# EasyEDA Pro project ProDoc_双路无刷电调_2025-08-21.epro, board PCB1_1
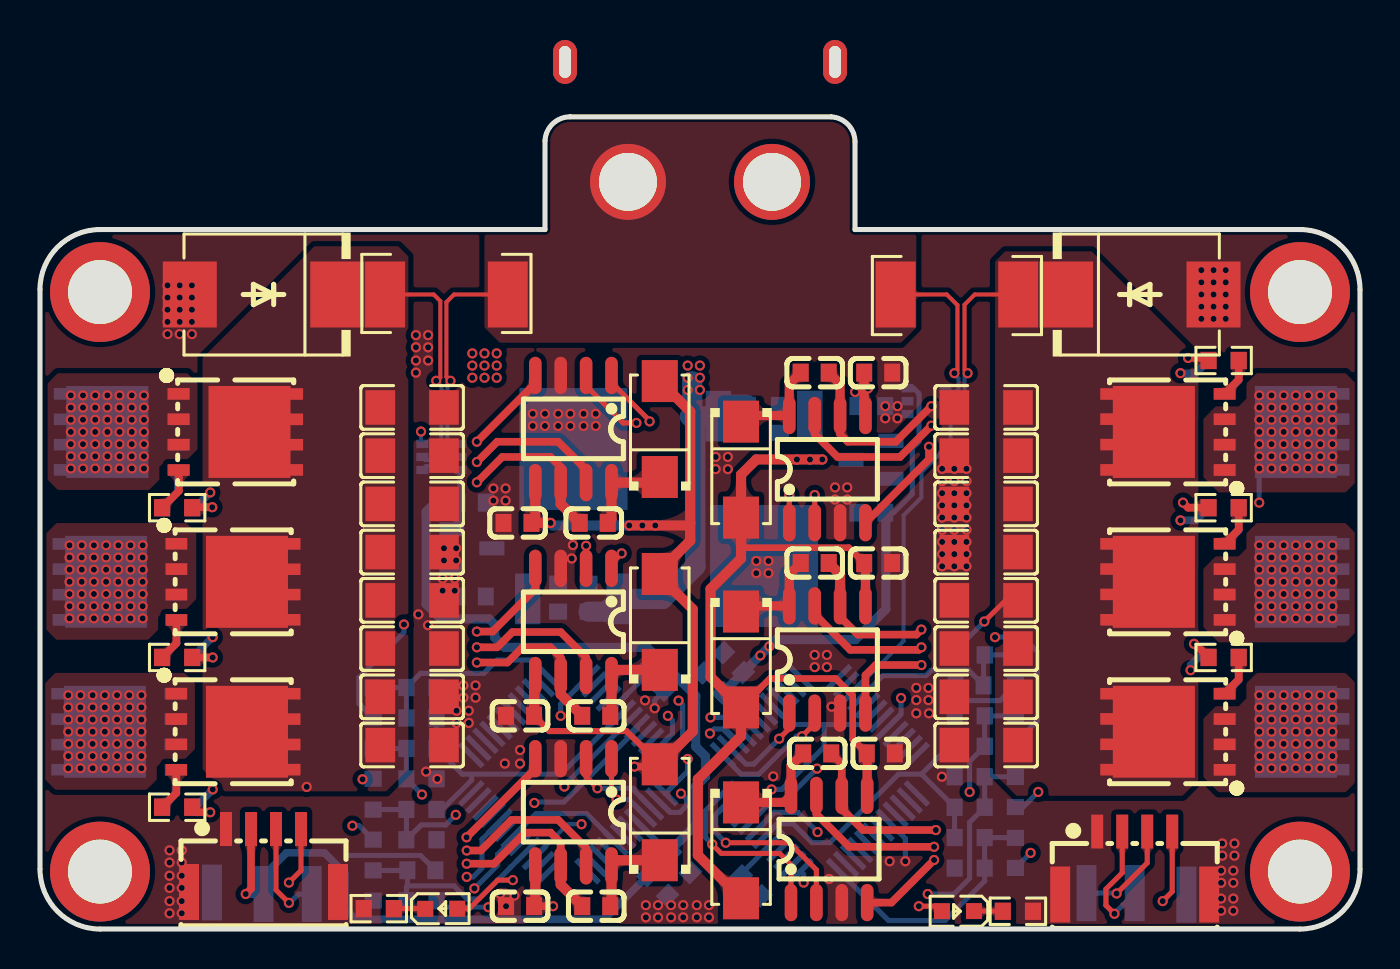
[diagram p2: board, top side]
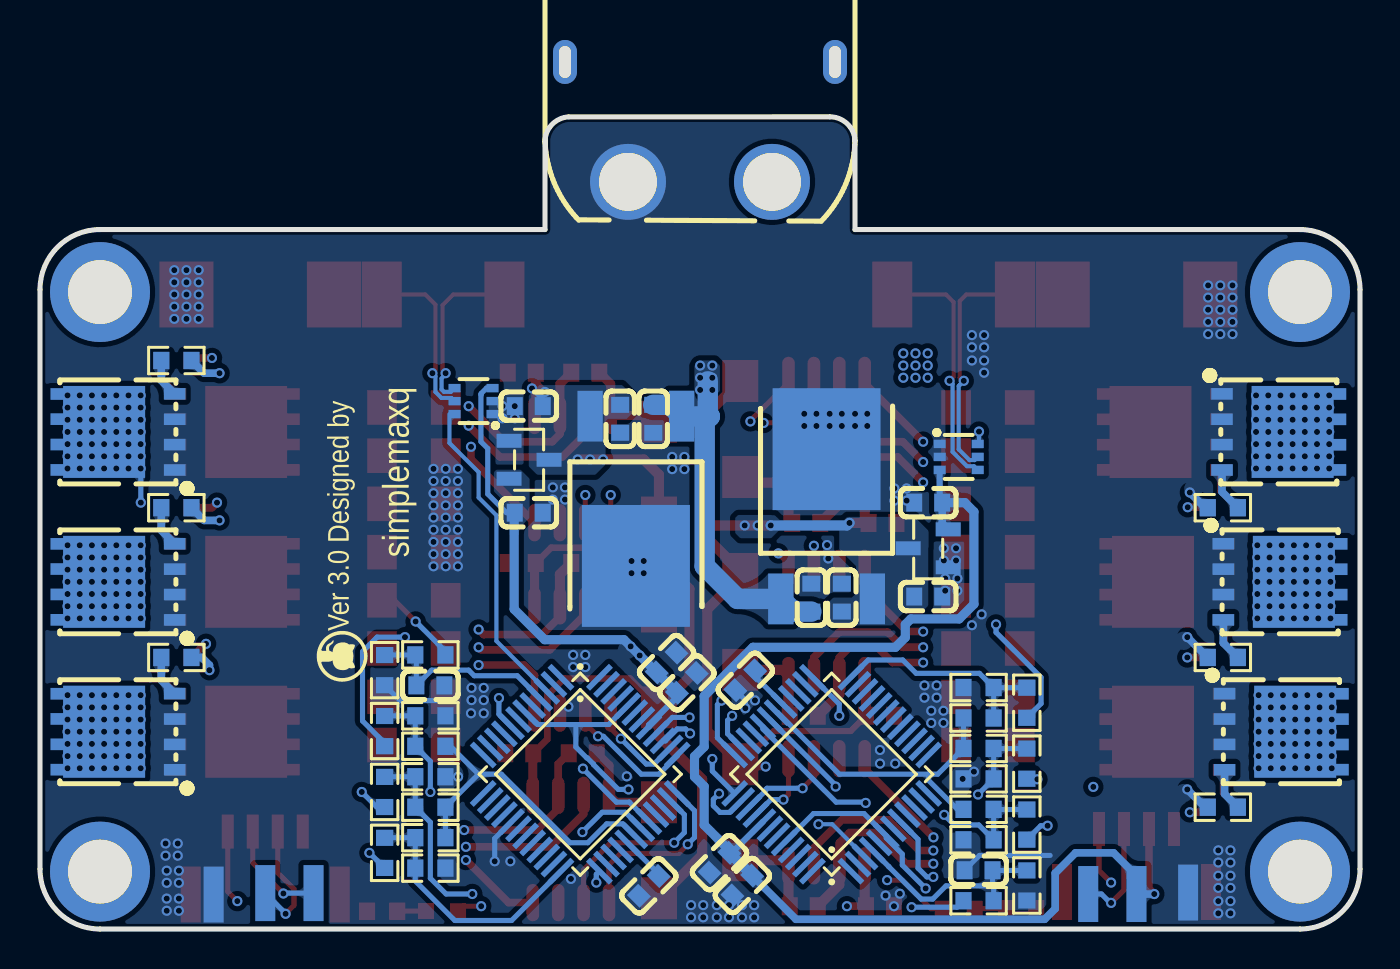
[diagram p3: board, bottom side, seen from below]

Outline 66 x 40.64 mm; copper layers: Top Layer, Inner1, Inner2, Bottom Layer. Coordinates in mm from the lower left corner of the outline.
Outline path: 0,32 arc(0.88,34.12) 3,35 25.25,35 25.25,39.45 arc(25.64,40.29) 26.5,40.64 39.56,40.64 arc(40.4,40.25) 40.75,39.39 40.75,35 63,35 arc(65.12,34.12) 66,32 66,3 arc(65.12,0.88) 63,0 3,0 arc(0.88,0.88) 0,3 0,32
Stack: Top Layer 0.035mm 外层铜厚1oz / Dielectric1 0.2104mm 7628 RC49% 8.6mil / Inner1 0.0152mm 内层铜厚 / Dielectric2 1.065mm 1.1mm H/HOZ Copper / Inner2 0.0152mm 内层铜厚 / Dielectric3 0.2104mm 7628 RC49% 8.6mil / Bottom Layer 0.035mm 外层铜厚1oz

## Design rules (mm)
template: 自定义配置
spacing copperThickness1oz (default): track to track 0.102, other pairs 0.152 to 0.3
spacing copperThickness2oz: track to track 0.203, other pairs 0.152 to 0.3
track width copperThickness1oz (default): min 0.127, default 0.254, max 2.54
track width copperThickness2oz: min 0.203, default 0.254, max 2.54
differential pair differentialPair (default): width min 0.127, default 0.254, max 2.54; gap min 0.152, default 0.152
via viaSize (default): diameter min 0.5, default 0.61, max 10; hole min 0.3, default 0.305, max 6.3

## Placement (name value [footprint] x y rotation side)
C6  10uF  [C0603]  24 1.14 180 top
C8  10uF  [C0603]  24 10.67 180 top
C10  10uF  [C0603]  23.88 20.32 180 top
C11  100uF  [C1206]  18.61 26.1 0 top
C12  100uF  [C1206]  18.61 23.69 0 top
C13  100uF  [C1206]  18.61 21.27 0 top
C14  100uF  [C1206]  18.61 18.86 0 top
C15  100uF  [C1206]  18.61 16.45 0 top
C16  100uF  [C1206]  18.61 14.03 0 top
C17  100uF  [C1206]  18.61 11.62 0 top
C18  100uF  [C1206]  18.61 9.21 0 top
C19  10uF  [C0603]  27.43 16.58 90 bottom
C20  1uF  [C0603]  25.91 16.58 90 bottom
C21  10uF  [C0603]  21.59 16.64 180 bottom
C22  0.1uF  [C0603]  21.59 21.34 180 bottom
C23  2.2uF  [C0603]  30.73 12.45 135 bottom
C24  2.2uF  [C0603]  32.03 3.32 135 bottom
C25  0.1uF  [C0603]  30.88 2.18 135 bottom
C26  0.1uF  [C0603]  19.07 2.94 180 bottom
C30  100uF  [C1206]  47.31 26.1 180 top
C31  100uF  [C1206]  47.31 23.69 180 top
C32  100uF  [C1206]  47.31 21.27 180 top
C33  100uF  [C1206]  47.31 18.86 180 top
C34  100uF  [C1206]  47.31 16.45 180 top
C35  100uF  [C1206]  47.31 14.03 180 top
C36  100uF  [C1206]  47.31 9.21 180 top
C37  100uF  [C1206]  47.31 11.62 180 top
C38  10uF  [C0603]  42.04 8.79 0 top
C39  10uF  [C0603]  36.99 25.53 270 bottom
C40  10uF  [C0603]  41.91 18.31 0 top
C41  10uF  [C0603]  35.34 25.53 270 bottom
C42  1uF  [C0603]  41.56 26.16 0 bottom
C43  10uF  [C0603]  41.91 27.84 0 top
C44  0.1uF  [C0603]  41.56 20.83 0 bottom
C45  2.2uF  [C0603]  35.56 2.16 135 bottom
C46  2.2uF  [C0603]  33.66 12.32 315 bottom
C47  0.1uF  [C0603]  34.67 13.33 315 bottom
C48  0.1uF  [C0603]  46.48 12.19 0 bottom
C52  10uF  [C0603]  27.81 1.14 0 top
C53  10uF  [C0603]  27.81 10.67 0 top
C54  10uF  [C0603]  27.69 20.32 0 top
C55  10uF  [C0603]  38.73 27.84 180 top
C56  10uF  [C0603]  38.73 18.31 180 top
C57  10uF  [C0603]  38.86 8.79 180 top
CN1  XT60PW-M  [CONN-TH_XT60PW-M]  33 40.39 270 bottom
D1  SMCJ18A  [SMC_L6.9-W5.9-LS7.9-RD]  11.18 31.75 180 top
D5  SMCJ18A  [SMC_L6.9-W5.9-LS7.9-RD]  54.99 31.75 0 top
LED1  -  [LED_0603]  45.85 0.89 180 top
LED2  -  [LED_0603]  20.11 1.02 0 top
NOREF  -  [Pad_e138]  3 2.87 0 top
NOREF#2  -  [Pad_e1093]  13.59 1.75 180 top
NOREF#3  -  [Pad_e1141]  52.32 1.8 0 top
NOREF#4  -  [Pad_e142]  63 31.87 0 top
NOREF#5  -  [Pad_e139]  3 31.87 0 top
NOREF#6  -  [Pad_e1095]  8.59 1.83 180 top
NOREF#7  -  [Pad_e1094]  11.18 1.75 180 top
NOREF#8  -  [Pad_e1142]  54.74 1.8 0 top
NOREF#9  -  [Pad_e140]  63 2.87 0 top
NOREF#10  -  [Pad_e1143]  57.32 1.72 0 top
Q1  HYG013N03LS1C2  [PDFN-8_L5.8-W5.1-P1.27-LS6.1-BL]  9.65 9.87 270 top
Q2  HYG013N03LS1C2  [PDFN-8_L5.8-W5.1-P1.27-LS6.1-BL]  3.94 9.87 270 bottom
Q3  HYG013N03LS1C2  [PDFN-8_L5.8-W5.1-P1.27-LS6.1-BL]  9.65 17.37 270 top
Q4  HYG013N03LS1C2  [PDFN-8_L5.8-W5.1-P1.27-LS6.1-BL]  4 17.37 270 bottom
Q5  HYG013N03LS1C2  [PDFN-8_L5.8-W5.1-P1.27-LS6.1-BL]  9.78 24.87 270 top
Q6  HYG013N03LS1C2  [PDFN-8_L5.8-W5.1-P1.27-LS6.1-BL]  4.06 24.87 270 bottom
Q7  HYG013N03LS1C2  [PDFN-8_L5.8-W5.1-P1.27-LS6.1-BL]  56.39 24.87 90 top
Q8  HYG013N03LS1C2  [PDFN-8_L5.8-W5.1-P1.27-LS6.1-BL]  62.1 24.87 90 bottom
Q9  HYG013N03LS1C2  [PDFN-8_L5.8-W5.1-P1.27-LS6.1-BL]  56.39 17.37 90 top
Q10  HYG013N03LS1C2  [PDFN-8_L5.8-W5.1-P1.27-LS6.1-BL]  62.1 17.37 90 bottom
Q11  HYG013N03LS1C2  [PDFN-8_L5.8-W5.1-P1.27-LS6.1-BL]  56.39 9.87 90 top
Q12  HYG013N03LS1C2  [PDFN-8_L5.8-W5.1-P1.27-LS6.1-BL]  62.1 9.87 90 bottom
R1  10K  [R0603]  19.07 5.99 180 bottom
R2  10K  [R0603]  19.07 9.04 180 bottom
R3  10K  [R0603]  19.07 10.56 180 bottom
R4  1K  [R0603]  19.07 4.46 180 bottom
R5  1K  [R0603]  19.07 7.51 180 bottom
R6  1K  [R0603]  19.07 12.08 180 bottom
R7  10K  [R0603]  16.66 5.23 270 bottom
R8  10K  [R0603]  16.66 8.27 270 bottom
R9  10K  [R0603]  16.66 11.32 270 bottom
R10  10R  [R0603]  6.86 6.1 180 top
R11  10R  [R0603]  6.86 6.1 180 bottom
R12  10R  [R0603]  6.86 13.59 180 top
R13  10R  [R0603]  6.86 13.59 180 bottom
R14  10R  [R0603]  6.86 21.08 180 top
R15  10R  [R0603]  6.86 21.08 180 bottom
R17  10K  [R0603]  19.07 1.42 0 bottom
R18  1K  [R0603]  16.66 2.18 90 bottom
R19  10K  [R0603]  48.9 0.89 180 top
R20  10mΩ  [RES-SMD_L6.4-W3.2-R2512]  20.32 31.75 0 top
R21  10R  [R0603]  59.18 28.45 0 bottom
R22  10R  [R0603]  59.18 21.08 0 bottom
R23  10R  [R0603]  59.18 13.59 0 bottom
R24  10R  [R0603]  59.18 28.45 0 top
R25  10R  [R0603]  59.18 21.08 0 top
R26  10R  [R0603]  59.18 13.59 0 top
R27  10K  [R0603]  46.48 9.14 0 bottom
R28  10K  [R0603]  48.77 9.91 270 bottom
R29  10K  [R0603]  46.48 6.1 0 bottom
R30  10K  [R0603]  48.77 6.86 270 bottom
R31  10K  [R0603]  46.48 4.57 0 bottom
R32  10K  [R0603]  48.77 3.81 270 bottom
R33  1K  [R0603]  46.48 10.67 0 bottom
R34  1K  [R0603]  46.48 7.62 0 bottom
R35  1K  [R0603]  46.48 3.05 0 bottom
R36  10K  [R0603]  46.48 13.72 180 bottom
R37  1K  [R0603]  48.77 12.95 90 bottom
R38  10K  [R0603]  16.94 1.02 0 top
R39  10mΩ  [RES-SMD_L6.4-W3.2-R2512]  45.85 31.75 180 top
U1  AI8051U-34K64-QFP48  [LQFP-48_L7.0-W7.0-P0.50-LS9.0-BL_1]  26.42 7.75 135 bottom
U3  EG2181  [SOP-8_L4.9-W3.9-P1.27-LS6.0-BL]  26.67 5.84 180 top
U4  EG2181  [SOP-8_L4.9-W3.9-P1.27-LS6.0-BL]  26.67 15.37 180 top
U5  EG2181  [SOP-8_L4.9-W3.9-P1.27-LS6.0-BL]  26.67 25.02 180 top
U8  SS54  [SMA_L4.2-W2.6-LS5.1-RD]  30.99 5.84 90 top
U10  CJ7812  [TO-252-3_L6.5-W5.8-P4.58-BL]  26.67 20.27 180 bottom
U11  SE8550X2-HF  [SOT-23-3_L2.9-W1.3-P1.90-LS2.4-BR]  21.59 19.05 180 bottom
U12  INA199A1DCKR  [SC-70-6_L2.2-W1.3-P0.65-LS2.1-BR]  20.07 23.62 0 bottom
U13  WAFER-GH1.25-4PWB  [CONN-SMD_4P-P1.25_XUNPU_WAFER-GH1.25-4PWB]  11.18 3.43 0 top
U14  AI8051U-34K64-QFP48  [LQFP-48_L7.0-W7.0-P0.50-LS9.0-BL_1]  38.99 7.75 315 bottom
U15  EG2181  [SOP-8_L4.9-W3.9-P1.27-LS6.0-BL]  39.37 23.01 0 top
U16  EG2181  [SOP-8_L4.9-W3.9-P1.27-LS6.0-BL]  39.37 13.49 0 top
U17  EG2181  [SOP-8_L4.9-W3.9-P1.27-LS6.0-BL]  39.45 4.01 0 top
U18  CJ7812  [TO-252-3_L6.5-W5.8-P4.58-BL]  36.21 21.92 0 bottom
U19  SE8550X2-HF  [SOT-23-3_L2.9-W1.3-P1.90-LS2.4-BR]  41.55 23.48 0 bottom
U20  INA199A1DCKR  [SC-70-6_L2.2-W1.3-P0.65-LS2.1-BR]  44.32 26.42 180 bottom
U21  WAFER-GH1.25-4PWB  [CONN-SMD_4P-P1.25_XUNPU_WAFER-GH1.25-4PWB]  54.74 3.3 0 top
U22  SS54  [SMA_L4.2-W2.6-LS5.1-RD]  30.99 15.37 90 top
U23  SS54  [SMA_L4.2-W2.6-LS5.1-RD]  30.99 25.02 90 top
U24  SS54  [SMA_L4.2-W2.6-LS5.1-RD]  35.05 22.99 270 top
U25  SS54  [SMA_L4.2-W2.6-LS5.1-RD]  35.05 13.49 270 top
U26  SS54  [SMA_L4.2-W2.6-LS5.1-RD]  35.05 3.94 270 top

## Footprints (pads in the part's own frame, mm; a bottom-side part is the same pattern mirrored in y, then rotated)
C0603
  rect 0.8x0.9 smd: 1(-0.7,0) 2(0.7,0)
C1206
  rect 1.485x1.728 smd: 1(-1.593,0) 2(1.593,0)
CONN-SMD_4P-P1.25_XUNPU_WAFER-GH1.25-4PWB
  rect 0.6x1.7 smd: 1(-1.875,1.575) 2(-0.625,1.575) 3(0.625,1.575) 4(1.875,1.575)
  rect 1x2.8 smd: 5(3.725,-1.575) 6(-3.725,-1.575)
CONN-TH_XT60PW-M
  round 3.8 hole 2.9: 1(3,-3.6) 2(3,3.6)
  oval 2.2x1.2 hole 1.6x0.6: 3(-3,6.75) 4(-3,-6.75)
LED_0603
  rect 0.8x0.8 smd: 1(-0.851,-0.01) 2(0.75,-0.005)
LQFP-48_L7.0-W7.0-P0.50-LS9.0-BL_1
  rect 0.28x1.62 smd: 1(-2.75,-4.11) 2(-2.25,-4.11) 3(-1.75,-4.11) 4(-1.25,-4.11) 5(-0.75,-4.11) 6(-0.25,-4.11) 7(0.25,-4.11) 8(0.75,-4.11) 9(1.25,-4.11) 10(1.75,-4.11) 11(2.25,-4.11) 12(2.75,-4.11) 25(2.75,4.11) 26(2.25,4.11) 27(1.75,4.11) 28(1.25,4.11) 29(0.75,4.11) 30(0.25,4.11) 31(-0.25,4.11) 32(-0.75,4.11) 33(-1.25,4.11) 34(-1.75,4.11) 35(-2.25,4.11) 36(-2.75,4.11)
  rect 1.62x0.28 smd: 13(4.11,-2.75) 14(4.11,-2.25) 15(4.11,-1.75) 16(4.11,-1.25) 17(4.11,-0.75) 18(4.11,-0.25) 19(4.11,0.25) 20(4.11,0.75) 21(4.11,1.25) 22(4.11,1.75) 23(4.11,2.25) 24(4.11,2.75) 37(-4.11,2.75) 38(-4.11,2.25) 39(-4.11,1.75) 40(-4.11,1.25) 41(-4.11,0.75) 42(-4.11,0.25) 43(-4.11,-0.25) 44(-4.11,-0.75) 45(-4.11,-1.25) 46(-4.11,-1.75) 47(-4.11,-2.25) 48(-4.11,-2.75)
Pad_e138
  round 5 hole 3.2: 1(0,0)
Pad_e139
  round 5 hole 3.2: 1(0,0)
Pad_e140
  round 5 hole 3.2: 1(0,0)
Pad_e142
  round 5 hole 3.2: 1(0,0)
Pad_e1093
  rect 1x2.8 smd far side: 1(0,0)
Pad_e1094
  rect 1x2.8 smd far side: 2(0,0)
Pad_e1095
  rect 1x2.8 smd far side: 3(0,0)
Pad_e1141
  rect 1x2.8 smd far side: 1(0,0)
Pad_e1142
  rect 1x2.8 smd far side: 2(0,0)
Pad_e1143
  rect 1x2.8 smd far side: 3(0,0)
PDFN-8_L5.8-W5.1-P1.27-LS6.1-BL
  rect 0.58x1.079 smd: 1(-1.905,-2.834) 2(-0.635,-2.834) 3(0.635,-2.834) 4(1.905,-2.834)
  rect 0.58x1.08 smd: 5(1.9,2.834) 6(0.64,2.834) 7(-0.63,2.834) 8(-1.9,2.834)
  rect 4.6x4.1 smd: 9(0,0.695)
R0603
  rect 0.806x0.864 smd: 1(-0.753,0) 2(0.753,0)
RES-SMD_L6.4-W3.2-R2512
  rect 2x3.3 smd: 1(-3.067,0) 2(3.067,0)
SC-70-6_L2.2-W1.3-P0.65-LS2.1-BR
  rect 0.6x0.42 smd: 1(0.95,-0.65) 2(0.95,0) 3(0.95,0.65) 4(-0.95,0.65) 5(-0.95,0) 6(-0.95,-0.65)
SMA_L4.2-W2.6-LS5.1-RD
  rect 2.1x1.8 smd: 1(-2.4,0) 2(2.4,0)
SMC_L6.9-W5.9-LS7.9-RD
  rect 2.7x3.3 smd: 1(-3.687,0) 2(3.687,0)
SOP-8_L4.9-W3.9-P1.27-LS6.0-BL
  oval 0.63x1.865 smd: 1(-1.905,-2.683) 2(-0.635,-2.683) 3(0.635,-2.683) 4(1.905,-2.683) 5(1.905,2.683) 6(0.635,2.683) 7(-0.635,2.683) 8(-1.905,2.683)
SOT-23-3_L2.9-W1.3-P1.90-LS2.4-BR
  rect 1.25x0.7 smd: 1(1,-0.95) 2(1,0.95) 3(-1,0)
TO-252-3_L6.5-W5.8-P4.58-BL
  rect 1.27x2.54 smd: 1(-2.288,-3.747) 3(2.288,-3.745)
  rect 5.4x6.1 smd: 2(-0.002,3.747)

## Nets
As in the schematic, except:
5V: C44.2 C46.2 C47.2 NOREF#8.2 U14.41 U19.2 U20.3 U21.2
+5V: C22.2 C24.2 C25.2 NOREF#7.2 U1.41 U11.2 U12.3 U13.2
GND: C6.2 C8.2 C10.2 C11.2 C12.2 C13.2 C14.2 C15.2 C16.2 C17.2 C18.2 C19.2 C20.2 C21.2 C22.1 C23.1 C24.1 C25.1 C26.1 C30.2 C31.2 C32.2 C33.2 C34.2 C35.2 C36.2 C37.2 C38.2 C39.2 C40.2 C41.2 C42.2 C43.2 C44.1 C45.1 C46.1 C47.1 C48.1 CN1.1 D1.2 D5.2 NOREF#6.3 NOREF#10.3 Q2.1 Q2.2 Q2.3 Q4.1 Q4.2 Q4.3 Q6.1 Q6.2 Q6.3 Q8.1 Q8.2 Q8.3 Q10.1 Q10.2 Q10.3 Q12.1 Q12.2 Q12.3 R4.1 R5.1 R6.1 R18.1 R19.1 R33.1 R34.1 R35.1 R37.1 R38.1 U1.17 U3.3 U4.3 U5.3 U10.2 U11.1 U12.1 U12.2 U13.1 U13.5 U13.6 U14.17 U15.3 U16.3 U17.3 U18.2 U19.1 U20.1 U20.2 U21.1 U21.5 U21.6
INPUT: NOREF#2.1 U1.6 U1.44 U13.3
INPUT_2: NOREF#3.1 U14.6 U14.44 U21.3

Pads without a net: CN1 3 4; NOREF 1; NOREF#4 1; NOREF#5 1; NOREF#9 1; U1 1 2 5 7 9 10 11 12 13 14 15 16 18 19 20 21 22 23 27 28 33 34 42 43 45 46 47 48; U14 1 2 5 7 9 10 11 12 13 14 15 16 18 19 20 21 22 23 27 28 33 34 42 43 45 46 47 48

## Via types
v1: diameter 0.508, hole 0.305, Top Layer to Bottom Layer, 586 vias

## Routing (per net, layer and track width the routed paths; a pad name or vN(x,y) marks a point on that pad's centre or on a via; arc(x,y) is an arc through that point)
5V: length 61.5
  Top Layer w0.254: v1(53.72,0.76) 53.3,1.19 53.3,2 54.11,2.81 U21.2
  Inner2 w0.305: v1(53.72,0.76) 53.42,0.46 38.02,0.46 37.08,1.4 37.08,4.83 35.81,6.1 35.81,9.17 36.47,9.83 v1(36.47,14.14)
  Bottom Layer w0.254: v1(53.72,0.76) 53.72,0.78 NOREF#8.2 ; 42.26,20.83 42.67,20.83 43.61,21.77 43.61,24.04 43.95,24.39 43.95,26.74 43.94,26.75 43.94,26.8 43.67,27.07 43.37,27.07
  Bottom Layer w0.305: C46.2 34.06,11.82 34,11.76 35.55,10.2 U14.41
  Bottom Layer w0.457: C46.2 C47.2 v1(36.01,13.69) v1(36.47,14.14) 36.8,14.48 40.77,14.48 42.29,16 42.29,20.8 42.26,20.83
12V: length 53
  Top Layer w0.33: v1(40.76,26.87) 41.21,27.33 ; C38.1 40.64,9.49 40.64,11.68 39.79,12.54 36.5,12.54 35.05,11.09 ; C40.1 40.44,19.08 35.09,19.08 35.05,19.04
  Top Layer w0.457: C43.1 41.21,25.76 U15.5 ; C38.1 41.36,8.77 U17.5 ; U16.5 41.27,18.25 C40.1
  Top Layer w0.508: U26.2 32.89,3.7 32.89,7.49 35.05,9.65 35.05,11.09 33.53,12.61 33.53,17.02 35.05,18.54 U24.2 35.05,22.73 35.81,23.49 v1(37.85,23.49) v1(38.5,23.49) v1(39.12,23.49)
  Bottom Layer w0.254: v1(41.4,27.05) 40.86,26.51 C42.1
+5V: length 66.2
  Top Layer w0.381: U13.2 10.55,2.01 v1(10.29,1.75)
  Bottom Layer w0.305: C24.2 31.41,3.82 U1.41 ; 21.02,22.97 21.02,21.46 C22.2
  Bottom Layer w0.381: v1(10.29,1.75) NOREF#7.2 11.18,2.67 12.32,3.81 14.22,3.81 15.24,2.79 15.24,1.02 15.77,0.49 28.2,0.49 C25.2 ; C22.2 20.89,20.3 U11.2
  Bottom Layer w0.457: C22.2 19.76,21.34 19.3,20.88 19.3,16.26 20.04,15.52 22.45,15.52 22.73,15.24 22.73,14.59 23.23,14.1 30.35,14.1 32.79,11.66 32.79,9.12 33.27,8.64 33.27,7.62 32.79,7.14 32.79,5.2 31.53,3.94 C24.2
  Bottom Layer w0.508: C25.2 C24.2
+12V: length 54.3
  Top Layer w0.305: 24.7,10.67 25.47,9.91 29.32,9.91 U8.2
  Top Layer w0.381: U8.2 30.87,8.13 v1(29.72,8.13) ; 24.7,1.14 v1(25.65,1.14)
  Top Layer w0.508: 32.51,20.32 32.51,19.43 30.99,17.91 U22.2 30.99,17.65 32.64,16 32.64,9.89 U8.2 ; 32.51,20.32 32.51,25.89 U23.2 ; 32.51,20.32 32.38,20.19 v1(30.76,20.19) v1(30.12,20.19) v1(29.46,20.19) ; 24.7,10.67 24.7,12.68 U4.5 ; U3.5 24.76,1.2 24.7,1.14 ; v1(25.53,20.32) C10.1 24.76,20.51 U5.5
  Inner2 w0.381: v1(29.72,8.13) 29.72,5.21 v1(25.65,1.14)
  Bottom Layer w0.508: v1(25.53,20.32) 25.65,20.19 v1(29.46,20.19)
GND: length 11.4
  Bottom Layer w0.254: U14.17 43.26,4.53 v1(43.26,3.39) ; 45.72,11.43 48,11.43 R37.1 ; C23.1 30.73,11.46 v1(30.73,11.05) ; C26.1 19.03,3.68 15.49,3.68
  vias: v1(6.38,32.21) v1(6.38,31.6) v1(6.38,30.99) v1(6.38,30.38) v1(6.38,29.77) v1(6.48,3.94) v1(6.48,3.33) v1(6.48,2.67) v1(6.48,2.06) v1(6.48,1.4) v1(6.48,0.79) v1(6.98,32.21) v1(6.98,31.6) v1(6.98,30.99) v1(6.98,30.38) v1(6.98,29.77) v1(7.09,3.94) v1(7.09,3.33) v1(7.09,2.67) v1(7.09,2.06) v1(7.09,1.4) v1(7.09,0.79) v1(7.59,32.21) v1(7.59,31.6) v1(7.59,30.99) v1(7.59,30.38) v1(7.59,29.77) v1(18.8,29.72) v1(18.8,29.11) v1(18.8,28.45) v1(18.8,27.84) v1(18.92,15.74) v1(19.3,7.87) v1(19.41,29.72) v1(19.41,29.11) v1(19.41,28.45) v1(19.4,15.2) v1(19.87,7.51) v1(20.13,17.54) v1(20.13,16.93) v1(20.2,19.05) v1(20.2,18.44) v1(20.74,17.54) v1(20.74,16.93) v1(20.81,19.05) v1(20.81,18.44) v1(20.83,10.92) v1(20.83,10.31) v1(21.17,12.19) v1(21.17,11.58) v1(21.44,10.92) v1(21.44,10.31) v1(21.78,12.19) v1(21.78,11.58) v1(22.67,22.05) v1(22.67,21.44) v1(23.01,1.77) v1(23.24,8.28) v1(23.28,22.05) v1(23.28,21.44) v1(23.3,1.14) v1(23.72,1.67) v1(24,8.96) v1(24,8.28) v1(24.64,25.78) v1(24.64,25.17) v1(25.25,25.78) v1(25.25,25.17) v1(25.91,25.78) v1(25.91,25.17) v1(26.52,25.78) v1(26.52,25.17) v1(26.65,19.21) v1(26.58,18.54) v1(27.18,25.78) v1(27.18,25.17) v1(27.79,25.78) v1(27.79,25.17) v1(30.25,11.44) v1(30.29,1.19) v1(30.29,0.58) v1(30.9,1.19) v1(30.9,0.58) v1(31.55,1.2) v1(31.55,0.59) v1(32.16,1.2) v1(32.16,0.59) v1(32.84,1.2) v1(32.84,0.59) v1(33.45,1.2) v1(33.45,0.59) v1(33.78,23.62) v1(33.78,23.01) v1(34.39,23.62) v1(34.39,23.01) v1(35.81,18.41) v1(35.81,17.81) v1(36.42,18.41) v1(36.42,17.81) v1(36.66,7.64) v1(38.74,13.72) v1(38.74,13.11) v1(39.34,13.72) v1(39.34,13.11) v1(39.45,2.51) v1(39.58,11.12) v1(39.75,22.1) v1(39.75,21.49) v1(40.36,22.1) v1(40.36,21.49) v1(42.26,26.16) v1(42.26,25.55) v1(42.48,3.39) v1(42.87,26.16) v1(42.87,25.55) v1(43.81,12.06) v1(43.81,11.46) v1(43.81,10.79) v1(44.42,12.06) v1(44.42,11.46) v1(44.45,10.79) v1(45.11,23.03) v1(45.11,22.42) v1(45.11,21.81) v1(45.11,21.2) v1(45.11,20.59) v1(45.11,19.98) v1(45.11,19.37) v1(45.11,18.76) v1(45.11,18.15) v1(45.1,7.62) v1(45.72,23.03) v1(45.72,22.42) v1(45.72,21.81) v1(45.72,21.2) v1(45.72,20.59) v1(45.72,19.98) v1(45.72,19.37) v1(45.72,18.76) v1(45.72,18.15) v1(46.32,23.03) v1(46.32,22.42) v1(46.32,21.81) v1(46.32,21.2) v1(46.32,20.59) v1(46.32,19.98) v1(46.32,19.37) v1(46.32,18.76) v1(46.32,18.15) v1(58.07,32.97) v1(58.07,32.36) v1(58.07,31.75) v1(58.07,31.14) v1(58.07,30.53) v1(58.68,32.97) v1(58.68,32.36) v1(58.68,31.75) v1(58.68,31.14) v1(58.68,30.53) v1(59.11,4.28) v1(59.11,3.67) v1(59.06,2.92) v1(59.06,2.31) v1(59.06,1.52) v1(59.06,0.91) v1(59.29,32.97) v1(59.29,32.36) v1(59.29,31.75) v1(59.29,31.14) v1(59.29,30.53) v1(59.72,4.28) v1(59.72,3.67) v1(59.66,2.92) v1(59.66,2.31) v1(59.66,1.52) v1(59.66,0.91)
VBAT: length 51.4
  Top Layer w0.203: R39.2 45.34,31.75 45.87,31.22 45.87,27.97 v1(45.72,27.81) ; v1(20.52,27.43) 20.32,27.63 20.32,31.37 20.7,31.75 R20.2
  Inner2 w1.016: 32.64,27.05 32.64,34.15 CN1.2
  Bottom Layer w0.203: 45.27,27.07 45.46,26.88 45.8,26.88 45.92,27 45.92,27.55 45.72,27.75 v1(45.72,27.81) ; 19.12,22.97 19.3,23.16 19.65,23.16 20.37,23.88 20.37,27.28 v1(20.52,27.43)
  Bottom Layer w1.016: C41.1 34.48,26.23 U18.1 33.9,25.65 32.51,25.65 ; C19.1 28.32,15.88 U10.1 31.12,16.52 32.77,18.16 32.77,25.39 32.51,25.65 ; 32.51,25.65 32.61,25.75 32.61,27.4
  vias: v1(32.38,28.19) v1(32.38,27.58) v1(32.38,26.97) v1(32.99,28.19) v1(32.99,27.58) v1(32.99,26.97)
(no net):
  vias: v1(21.62,28.8) v1(21.62,28.19) v1(21.62,27.58) v1(22.22,28.8) v1(22.22,28.19) v1(22.22,27.58) v1(22.83,28.8) v1(22.83,28.19) v1(22.83,27.58)
ADC_CURRENT: length 29.4
  Inner2 w0.203: v1(27.08,5.24) 27.08,7.47 26.67,7.87 26.67,15.37 26.03,16 26.03,22.61 23.75,24.89 v1(19.05,24.89)
  Bottom Layer w0.203: U12.6 19.05,24.34 v1(19.05,24.89) ; v1(27.08,5.24) 26.39,5.24 U1.3
ADC_CURRENT_2: length 15.9
  Bottom Layer w0.203: U14.3 43.18,14.41 43.18,20.7 44.07,21.59 44.07,22.86 45.53,24.32 45.53,25.77
ADC_VOLTAGE: length 10.6
  Bottom Layer w0.254: C26.2 18.36,2.93 ; 18.36,2.93 18.37,2.92 18.37,2.17 ; 18.36,2.93 16.66,2.93 ; 18.37,2.17 18.38,2.16 20.7,2.16 21.36,1.5 21.94,1.5 23.56,3.11 23.56,3.12 U1.4 ; 18.37,2.17 18.32,2.11 R17.1
ADC_VOLTAGE_2: length 10.2
  Bottom Layer w0.254: R37.2 48.76,13.72 R36.1 47.18,13.66 C48.2 46.42,12.95 44.57,12.95 44.29,12.67 42.14,12.67 41.01,11.55 U14.4
AI_H: length 3.8
  Top Layer w0.254: v1(28.83,6.48) 28.57,6.73 U3.1
  Bottom Layer w0.254: U1.40 29.45,6.48 v1(28.83,6.48)
AI_H_2: length 18.9
  Top Layer w0.254: v1(37.47,21.72) U15.1
  Inner2 w0.254: v1(33.52,10.59) 33.15,10.96 33.15,21.21 33.91,21.97 37.21,21.97 v1(37.47,21.72)
  Bottom Layer w0.254: v1(33.52,10.59) 34.38,10.59 35.2,9.77
AI_L: length 4.8
  Top Layer w0.254: v1(27.87,7.04) 27.31,7.61 U3.2
  Bottom Layer w0.254: U1.39 29.72,6.92 29.72,6.98 29.65,7.04 v1(27.87,7.04)
AI_L_2: length 22
  Top Layer w0.254: U15.2 v1(38.73,21.72)
  Inner2 w0.254: v1(33.5,9.79) 32.51,10.77 32.51,21.34 33.66,22.48 37.97,22.48 v1(38.73,21.72)
  Bottom Layer w0.254: U14.39 34.73,9.42 34.13,10.01 33.72,10.01 v1(33.5,9.79)
AO_H: length 22.7
  Top Layer w0.381: v1(8.51,5.84) 7.87,5.84 R10.1 ; v1(21.34,3.93) 22.04,3.93 23.58,5.46 25.91,5.46 27.31,4.06 U3.7
  Inner2 w0.381: v1(8.51,5.84) 10.42,3.93 v1(21.34,3.93)
AO_H_2: length 23.2
  Top Layer w0.381: v1(44.57,25.19) 43,23.62 39.88,23.62 38.73,24.77 U15.7 ; v1(57.4,28.57) 58.3,28.57 R24.1
  Inner2 w0.381: v1(44.57,25.19) 45.54,26.16 53.47,26.16 55.88,28.57 v1(57.4,28.57)
AO_L: length 20.5
  Top Layer w0.381: U3.4 24.76,8.03 v1(21.33,4.59)
  Inner2 w0.381: v1(21.33,4.59) 15.88,4.59 15.87,4.57 15.37,4.57 15.35,4.6 11.02,4.6 v1(8.64,6.98)
  Bottom Layer w0.381: v1(8.64,6.98) 7.75,6.1 R11.1
AO_L_2: length 20.9
  Top Layer w0.381: v1(44.45,24.13) 44.45,23.51 U15.4
  Inner2 w0.381: v1(44.45,24.13) 45.72,25.4 54.61,25.4 v1(57.02,27.81)
  Bottom Layer w0.381: v1(57.02,27.81) 57.79,27.81 R21.1
BI_H: length 16.7
  Top Layer w0.254: U4.1 28.57,18.29 v1(29.08,18.8)
  Inner2 w0.254: v1(29.08,18.8) 29.08,11.05 32.05,8.08 v1(32.05,6.78)
  Bottom Layer w0.254: 30.91,6.43 31.51,5.83 32,5.83 32.33,6.17 32.33,6.49 v1(32.05,6.78)
BI_H_2: length 4.8
  Top Layer w0.254: U16.1 37.46,10.03 v1(36.96,9.52)
  Bottom Layer w0.254: 34.49,9.06 35.3,8.25 35.69,8.25 v1(36.96,9.52)
BI_L: length 17.7
  Top Layer w0.254: v1(27.31,19.18) U4.2
  Inner2 w0.254: v1(32.38,8.51) 29.62,11.28 29.62,19.18 29.36,19.43 27.56,19.43 v1(27.31,19.18)
  Bottom Layer w0.254: v1(32.38,8.51) 32.38,7.9 31.27,6.79
BI_L_2: length 6.6
  Top Layer w0.254: v1(38.1,9.64) 38.73,10.28 U16.2
  Bottom Layer w0.254: U14.37 34.14,8.66 35.05,7.75 35.93,7.75 37.83,9.64 v1(38.1,9.64)
BO_H: length 21.7
  Top Layer w0.381: v1(21.84,14.1) 22.86,14.1 23.62,14.86 26.03,14.86 27.31,13.59 U4.7 ; v1(8.64,13.59) R12.1
  Inner2 w0.381: v1(21.84,14.1) 21.72,13.97 9.02,13.97 v1(8.64,13.59)
BO_H_2: length 24
  Top Layer w0.381: v1(57.15,21.34) 57.4,21.08 R25.1 ; U16.7 38.73,15.75 40.51,13.97 43.94,13.97 v1(44.07,14.1)
  Inner2 w0.381: v1(44.07,14.1) 51.31,21.34 v1(57.15,21.34)
BO_L: length 19.6
  Top Layer w0.381: U4.4 24.76,17.02 22.63,14.88 v1(21.84,14.88)
  Inner2 w0.381: v1(21.84,14.88) 21.79,14.88 21.51,14.6 v1(8.64,14.6)
  Bottom Layer w0.381: v1(8.64,14.6) 7.62,13.59 R13.1
BO_L_2: length 22.5
  Top Layer w0.381: v1(44.07,13.21) 41.78,13.21 41.27,12.7 U16.4
  Inner2 w0.381: v1(57.02,20.45) 51.31,20.45 v1(44.07,13.21)
  Bottom Layer w0.381: R22.1 57.79,20.45 v1(57.02,20.45)
CI_H: length 20.8
  Top Layer w0.254: U5.1 28.57,27.34 30.48,25.44 v1(30.48,25.4)
  Inner2 w0.254: v1(30.48,25.4) 30.48,23.88 31.93,22.43 v1(31.93,11.43)
  Bottom Layer w0.254: v1(31.93,11.43) 32.13,11.23 32.13,9.57 31.27,8.71
CI_H_2: length 9.3
  Top Layer w0.254: v1(33.61,4.24) 33.61,4.23 34.06,3.78 36.98,3.78 37.55,3.22 U17.1
  Bottom Layer w0.254: U14.36 33.27,5.92 33.27,4.58 v1(33.61,4.24)
CI_L: length 21.1
  Top Layer w0.254: U5.2 27.31,27.18 29.16,25.32 v1(29.82,25.32)
  Inner2 w0.254: v1(31.39,10.67) 31.39,21.95 29.82,23.52 v1(29.82,25.32)
  Bottom Layer w0.254: 30.91,9.06 31.62,9.77 31.62,10.44 v1(31.39,10.67)
CI_L_2: length 9.3
  Top Layer w0.254: v1(34.29,4.32) 37.47,4.32 38.82,2.96 U17.2
  Bottom Layer w0.254: v1(34.29,4.32) 33.78,4.83 33.78,5.72 34.49,6.43
CMP_O: length 13.8
  Top Layer w0.254: LED2.2 21.46,1.02 22.89,2.45 v1(23.64,2.45)
  Inner2 w0.254: v1(26.22,7.13) 26.22,5.02 v1(23.64,2.45)
  Bottom Layer w0.254: v1(26.22,7.13) 26.22,7.2 29.5,10.48
CMP_O_2: length 15.1
  Top Layer w0.254: v1(43.94,1.14) 44.85,1.14 LED1.2
  Inner2 w0.254: v1(43.94,1.14) 38.48,1.14 37.59,2.03 37.59,3.56 v1(38.88,4.85)
  Bottom Layer w0.254: v1(38.88,4.85) 37.89,5.84 36.73,5.84 U14.31
CO_H: length 22.3
  Top Layer w0.381: U5.7 27.31,22.99 25.91,24.38 22.86,24.38 v1(21.84,23.37) ; v1(8.61,21.11) 7.64,21.11 R14.1
  Inner2 w0.381: v1(21.84,23.37) 19.58,21.11 v1(8.61,21.11)
CO_H_2: length 32.7
  Top Layer w0.381: v1(57.7,14.27) 57.87,14.1 57.92,14.1 R26.1 ; U17.7 38.82,5.75 40.46,4.11 v1(44.7,4.11)
  Inner2 w0.381: v1(57.7,14.27) 58.29,13.68 58.29,6.73 57.13,5.57 44.43,5.57 44.07,5.21 44.07,4.44 44.4,4.11 v1(44.7,4.11)
CO_L: length 20.1
  Top Layer w0.381: v1(21.84,24.38) 24.76,27.3 U5.4
  Inner2 w0.381: v1(21.84,24.38) 19.3,21.84 v1(8.51,21.84)
  Bottom Layer w0.381: v1(8.51,21.84) 7.75,21.08 R15.1
CO_L_2: length 29
  Top Layer w0.381: U17.4 42.57,1.32 v1(44.7,3.45)
  Inner2 w0.381: v1(57.53,12.95) 57.53,7.36 56.43,6.26 44.11,6.26 43.31,5.46 43.31,4.32 44.17,3.45 v1(44.7,3.45)
  Bottom Layer w0.381: v1(57.53,12.95) 57.53,13.21 57.91,13.59 R23.1
EMF_A: length 17.1
  Inner2 w0.254: v1(20.79,5.71) 21.05,5.97 24.38,5.97 v1(24.72,6.31)
  Bottom Layer w0.254: U1.32 29.85,10.01 26.19,6.35 24.76,6.35 v1(24.72,6.31) ; 16.66,5.98 18.31,5.98 R1.2 R4.2 19.06,5.21 20.28,5.21 v1(20.79,5.71)
EMF_A_2: length 18.2
  Inner2 w0.254: v1(46.48,6.86) 40.02,6.86 v1(38.85,8.03)
  Bottom Layer w0.254: R28.1 48.76,10.67 R33.2 R27.2 46.48,8.39 v1(46.48,6.86) ; U14.32 36.53,6.35 37.18,6.35 v1(38.85,8.03)
EMF_B: length 16.9
  Inner2 w0.254: v1(19.1,6.73) 20.44,6.73 20.69,6.48 24.13,6.48 26.03,8.38 v1(26.03,10.67)
  Bottom Layer w0.254: U1.25 26.03,11.25 v1(26.03,10.67) ; v1(19.1,6.73) R5.2 R2.2 18.31,9.03 16.66,9.03
EMF_B_2: length 16.5
  Inner2 w0.254: v1(44.39,1.75) 38.63,1.75 38.18,2.2 v1(38.18,2.32)
  Bottom Layer w0.254: U14.25 38.18,2.74 v1(38.18,2.32) ; R30.1 48.76,7.62 R34.2 R29.2 46.48,5.34 46.48,2.54 45.69,1.75 v1(44.39,1.75)
EMF_C: length 11.3
  Bottom Layer w0.254: R6.2 19.03,12.8 22.19,12.8 22.86,13.46 24.59,13.46 U1.24 ; R6.2 18.31,12.08 16.66,12.08 ; R6.2 R3.2
EMF_C_2: length 12.8
  Bottom Layer w0.254: R32.1 48.76,4.57 R31.2 R35.2 47.24,2.4 45.26,0.43 42.42,0.43 U14.24
EMF_COM: length 15.3
  Bottom Layer w0.254: 21.58,7.75 21.58,7.45 20.12,5.99 R1.1 ; 21.58,7.75 26.03,7.75 29.12,10.83 U1.30 ; 21.58,7.75 21.11,7.75 R2.1 R3.1
EMF_COM_2: length 16
  Bottom Layer w0.254: 44.08,7.75 42.93,7.75 39.5,4.32 38.61,4.32 37.66,5.26 36.86,5.26 U14.30 ; 44.08,7.75 R29.1 R31.1 ; 44.08,7.75 45.47,9.14 R27.1
INPUT: length 24.5
  Top Layer w0.254: v1(12.45,1.31) 11.8,1.95 U13.3
  Inner2 w0.254: v1(12.45,1.31) 13.17,2.03 v1(21.72,2.03)
  Bottom Layer w0.254: NOREF#2.1 12.93,1.75 12.48,1.31 v1(12.45,1.31) ; v1(21.72,2.03) 22.88,3.2 22.88,3.75 23.69,4.55 U1.6 24.8,5.78 27.32,5.78 U1.44
INPUT_2: length 36.5
  Top Layer w0.254: U21.3 55.36,3.31 v1(53.83,1.78)
  Inner2 w0.254: v1(36.58,6.98) 36.58,6.22 37.26,5.54 38.95,5.54 39.5,4.99 39.5,3.3 40.51,2.29 53.32,2.29 v1(53.83,1.78)
  Bottom Layer w0.254: U14.6 41.12,10.23 39.21,10.23 ; v1(53.83,1.78) 53.81,1.8 NOREF#3.1 ; 39.21,10.23 37.56,10.23 36.61,11.18 ; 39.21,10.23 39.21,9.11 38.66,8.56 38.63,8.56 38.32,8.25 38.32,8.22 37.08,6.98 v1(36.58,6.98)
TXD_P31: length 15.6
  Top Layer w0.254: U13.4 13.05,2.93 v1(12.45,2.32)
  Inner2 w0.254: v1(21.34,2.61) 12.73,2.61 v1(12.45,2.32)
  Bottom Layer w0.254: v1(21.34,2.61) 21.66,2.61 22.1,3.05 22.1,4.49 U1.8
TXD_P31_2: length 36.2
  Top Layer w0.254: U21.4 56.61,1.87 v1(56.13,1.4)
  Inner2 w0.254: v1(56.13,1.4) 54.74,2.79 40.77,2.79 40,3.56 40,5.33 39.31,6.03 37.78,6.03 37.21,6.6 37.21,8 40.77,11.56 v1(43.05,11.56)
  Bottom Layer w0.254: v1(43.05,11.56) 43.05,10.75 U14.8
V_MOS: length 27.9
  Top Layer w0.203: R20.1 19.69,31.75 20.01,31.42 20.01,27.59 19.81,27.39
  Inner2 w0.254: v1(22.42,1.09) 22.42,2.08 21.97,2.53 21.97,4.7 21.49,5.18 16.79,5.18 16.26,5.71 14.73,5.71 v1(13.34,7.11)
  Bottom Layer w0.203: v1(19.81,27.43) 20.01,27.23 20.01,27.22 20.07,27.17 20.07,24 19.53,23.46 19.27,23.46 U12.5
  Bottom Layer w0.254: v1(22.42,1.09) 20.15,1.09 R17.2
V_MOS_2: length 12.9
  Top Layer w0.203: v1(46.38,27.81) 46.23,27.97 46.23,31.24 46.74,31.75 R39.1
  Top Layer w0.254: v1(47.22,15.39) 48.28,16.45 C34.1
  Bottom Layer w0.203: U20.5 45.43,26.57 45.93,26.57 46.23,26.87 46.23,27.66 v1(46.38,27.81)
  Bottom Layer w0.254: R36.2 45.73,13.9 v1(47.22,15.39)
VS_A: length 39.7
  Top Layer w0.381: v1(21.34,3.27) 22.7,3.27 24.26,4.83 25.53,4.83 26.03,4.32 U3.6
  Top Layer w0.508: C52.1 26.03,2.22 U3.6
  Inner2 w0.254: 5.62,7.49 5.65,7.52 9.12,7.52 11.47,5.17 v1(15.62,5.17)
  Inner2 w0.381: v1(5.07,8.04) 9.85,3.27 v1(21.34,3.27)
  Bottom Layer w0.254: v1(15.62,5.17) 15.96,5.17 R7.2
  vias: v1(1.41,11.7) v1(1.41,11.09) v1(1.41,10.48) v1(1.41,9.87) v1(1.41,9.26) v1(1.41,8.65) v1(1.41,8.04) v1(2.02,11.7) v1(2.02,11.09) v1(2.02,10.48) v1(2.02,9.87) v1(2.02,9.26) v1(2.02,8.65) v1(2.02,8.04) v1(2.63,11.7) v1(2.63,11.09) v1(2.63,10.48) v1(2.63,9.87) v1(2.63,9.26) v1(2.63,8.65) v1(2.63,8.04) v1(3.24,11.7) v1(3.24,11.09) v1(3.24,10.48) v1(3.24,9.87) v1(3.24,9.26) v1(3.24,8.65) v1(3.24,8.04) v1(3.85,11.7) v1(3.85,11.09) v1(3.85,10.48) v1(3.85,9.87) v1(3.85,9.26) v1(3.85,8.65) v1(3.85,8.04) v1(4.46,11.7) v1(4.46,11.09) v1(4.46,10.48) v1(4.46,9.87) v1(4.46,9.26) v1(4.46,8.65) v1(4.46,8.04) v1(5.07,11.7) v1(5.07,11.09) v1(5.07,10.48) v1(5.07,9.87) v1(5.07,9.26) v1(5.07,8.65)
VS_A_2: length 54.3
  Top Layer w0.381: U15.6 40,24.77 40.39,24.38 42.79,24.38 v1(44.57,26.16)
  Top Layer w0.457: U15.6 40,27.27 C55.1
  Inner2 w0.254: v1(60.96,21.34) 58.8,21.34 57.28,19.81 51.69,19.81 47.75,15.87 v1(47.75,14.6)
  Inner2 w0.381: 60.96,26.8 60.96,27.94 59.56,29.34 55.75,29.34 53.34,26.92 45.33,26.92 v1(44.57,26.16)
  Bottom Layer w0.254: R28.2 48.77,9.31 49.87,10.41 49.87,13.88 49.15,14.6 v1(47.75,14.6) ; v1(60.97,23.04) 60.96,23.04 v1(60.96,21.34)
  vias: v1(60.97,26.7) v1(60.97,26.09) v1(60.97,25.48) v1(60.97,24.87) v1(60.97,24.26) v1(60.97,23.65) v1(61.58,26.7) v1(61.58,26.09) v1(61.58,25.48) v1(61.58,24.87) v1(61.58,24.26) v1(61.58,23.65) v1(61.58,23.04) v1(62.19,26.7) v1(62.19,26.09) v1(62.19,25.48) v1(62.19,24.87) v1(62.19,24.26) v1(62.19,23.65) v1(62.19,23.04) v1(62.79,26.7) v1(62.79,26.09) v1(62.79,25.48) v1(62.79,24.87) v1(62.79,24.26) v1(62.79,23.65) v1(62.79,23.04) v1(63.4,26.7) v1(63.4,26.09) v1(63.4,25.48) v1(63.4,24.87) v1(63.4,24.26) v1(63.4,23.65) v1(63.4,23.04) v1(64.01,26.7) v1(64.01,26.09) v1(64.01,25.48) v1(64.01,24.87) v1(64.01,24.26) v1(64.01,23.65) v1(64.01,23.04) v1(64.62,26.7) v1(64.62,26.09) v1(64.62,25.48) v1(64.62,24.87) v1(64.62,24.26) v1(64.62,23.65) v1(64.62,23.04)
VS_B: length 44.5
  Top Layer w0.381: U4.6 26.03,13.59 25.53,14.1 24.13,14.1 23.37,13.33 v1(21.84,13.33)
  Top Layer w0.508: C53.1 26.03,11.75 U4.6
  Inner2 w0.254: v1(16.13,7.49) 15.62,8 15.62,11.94 14.86,12.7 9.91,12.7 9.53,12.32 7.11,12.32 4.52,14.91 v1(4.52,15.54)
  Inner2 w0.381: v1(5.13,15.54) 7.72,12.95 9.14,12.95 9.53,13.33 v1(21.84,13.33)
  Bottom Layer w0.254: R8.2 16.16,7.52 v1(16.13,7.49)
  vias: v1(1.48,19.2) v1(1.48,18.59) v1(1.48,17.98) v1(1.48,17.37) v1(1.48,16.76) v1(1.48,16.15) v1(1.48,15.54) v1(2.09,19.2) v1(2.09,18.59) v1(2.09,17.98) v1(2.09,17.37) v1(2.09,16.76) v1(2.09,16.15) v1(2.09,15.54) v1(2.7,19.2) v1(2.7,18.59) v1(2.7,17.98) v1(2.7,17.37) v1(2.7,16.76) v1(2.7,16.15) v1(2.7,15.54) v1(3.31,19.2) v1(3.31,18.59) v1(3.31,17.98) v1(3.31,17.37) v1(3.31,16.76) v1(3.31,16.15) v1(3.31,15.54) v1(3.91,19.2) v1(3.91,18.59) v1(3.91,17.98) v1(3.91,17.37) v1(3.91,16.76) v1(3.91,16.15) v1(3.91,15.54) v1(4.52,19.2) v1(4.52,18.59) v1(4.52,17.98) v1(4.52,17.37) v1(4.52,16.76) v1(4.52,16.15) v1(5.13,19.2) v1(5.13,18.59) v1(5.13,17.98) v1(5.13,17.37) v1(5.13,16.76) v1(5.13,16.15)
VS_B_2: length 50.9
  Top Layer w0.381: v1(44.07,14.99) 43.81,14.73 40.89,14.73 40,15.62 U16.6
  Top Layer w0.508: U16.6 40,17.74 C56.1
  Inner1 w0.381: 60.96,19.21 v1(60.97,19.2)
  Inner2 w0.254: v1(49.91,6.86) 50.04,6.98 56.13,6.98 56.9,7.75 56.9,14.35 57.43,14.88 60.31,14.88 v1(60.97,15.54)
  Inner2 w0.381: v1(44.07,14.99) 51.18,22.1 61.34,22.1 62.19,21.25 v1(62.19,19.2)
  Bottom Layer w0.254: v1(49.91,6.86) 49.16,6.1 R30.2
  vias: v1(60.97,18.59) v1(60.97,17.98) v1(60.97,17.37) v1(60.97,16.76) v1(60.97,16.15) v1(61.58,19.2) v1(61.58,18.59) v1(61.58,17.98) v1(61.58,17.37) v1(61.58,16.76) v1(61.58,16.15) v1(61.58,15.54) v1(62.19,18.59) v1(62.19,17.98) v1(62.19,17.37) v1(62.19,16.76) v1(62.19,16.15) v1(62.19,15.54) v1(62.79,19.2) v1(62.79,18.59) v1(62.79,17.98) v1(62.79,17.37) v1(62.79,16.76) v1(62.79,16.15) v1(62.79,15.54) v1(63.4,19.2) v1(63.4,18.59) v1(63.4,17.98) v1(63.4,17.37) v1(63.4,16.76) v1(63.4,16.15) v1(63.4,15.54) v1(64.01,19.2) v1(64.01,18.59) v1(64.01,17.98) v1(64.01,17.37) v1(64.01,16.76) v1(64.01,16.15) v1(64.01,15.54) v1(64.62,19.2) v1(64.62,18.59) v1(64.62,17.98) v1(64.62,17.37) v1(64.62,16.76) v1(64.62,16.15) v1(64.62,15.54)
VS_C: length 53.1
  Top Layer w0.381: U5.6 26.03,23.11 25.53,23.62 23.11,23.62 v1(21.84,22.35)
  Top Layer w0.508: U5.6 26.03,21.27 C54.1
  Inner2 w0.254: v1(3.98,23.04) 3.98,21.42 5.59,19.81 14.99,19.81 18.2,16.6 v1(18.2,15.24)
  Inner2 w0.381: v1(4.59,23.04) 4.57,23.03 4.57,21.72 5.84,20.45 19.94,20.45 v1(21.84,22.35)
  Bottom Layer w0.254: v1(18.2,15.24) 18.2,14.84 15.95,12.59 15.95,11.28 R9.2
  vias: v1(1.54,26.7) v1(1.54,26.09) v1(1.54,25.48) v1(1.54,24.87) v1(1.54,24.26) v1(1.54,23.65) v1(1.54,23.04) v1(2.15,26.7) v1(2.15,26.09) v1(2.15,25.48) v1(2.15,24.87) v1(2.15,24.26) v1(2.15,23.65) v1(2.15,23.04) v1(2.76,26.7) v1(2.76,26.09) v1(2.76,25.48) v1(2.76,24.87) v1(2.76,24.26) v1(2.76,23.65) v1(2.76,23.04) v1(3.37,26.7) v1(3.37,26.09) v1(3.37,25.48) v1(3.37,24.87) v1(3.37,24.26) v1(3.37,23.65) v1(3.37,23.04) v1(3.98,26.7) v1(3.98,26.09) v1(3.98,25.48) v1(3.98,24.87) v1(3.98,24.26) v1(3.98,23.65) v1(4.59,26.7) v1(4.59,26.09) v1(4.59,25.48) v1(4.59,24.87) v1(4.59,24.26) v1(4.59,23.65) v1(5.2,26.7) v1(5.2,26.09) v1(5.2,25.48) v1(5.2,24.87) v1(5.2,24.26) v1(5.2,23.65) v1(5.2,23.04)
VS_C_2: length 40.8
  Top Layer w0.381: v1(44.79,4.95) 41.15,4.95 40.09,6.01 U17.6 40.09,8.26 C57.1
  Inner2 w0.254: v1(61.58,8.04) 61.58,7.6 58.17,4.19 49.91,4.19 v1(49.53,3.81)
  Inner2 w0.381: v1(60.97,8.04) 57.75,4.83 44.92,4.83 v1(44.79,4.95)
  Bottom Layer w0.254: R32.2 49.52,3.81 v1(49.53,3.81)
  vias: v1(60.97,11.7) v1(60.97,11.09) v1(60.97,10.48) v1(60.97,9.87) v1(60.97,9.26) v1(60.97,8.65) v1(61.58,11.7) v1(61.58,11.09) v1(61.58,10.48) v1(61.58,9.87) v1(61.58,9.26) v1(61.58,8.65) v1(62.19,11.7) v1(62.19,11.09) v1(62.19,10.48) v1(62.19,9.87) v1(62.19,9.26) v1(62.19,8.65) v1(62.19,8.04) v1(62.79,11.7) v1(62.79,11.09) v1(62.79,10.48) v1(62.79,9.87) v1(62.79,9.26) v1(62.79,8.65) v1(62.79,8.04) v1(63.4,11.7) v1(63.4,11.09) v1(63.4,10.48) v1(63.4,9.87) v1(63.4,9.26) v1(63.4,8.65) v1(63.4,8.04) v1(64.01,11.7) v1(64.01,11.09) v1(64.01,10.48) v1(64.01,9.87) v1(64.01,9.26) v1(64.01,8.65) v1(64.01,8.04) v1(64.62,11.7) v1(64.62,11.09) v1(64.62,10.48) v1(64.62,9.87) v1(64.62,9.26) v1(64.62,8.65) v1(64.62,8.04)
$1N2898: length 2.1
  Bottom Layer w0.381: R11.2 6.77,6.76 Q2.4
$1N2899: length 2.2
  Bottom Layer w0.381: Q4.4 6.83,14.32 R13.2
$1N2900: length 2.2
  Bottom Layer w0.381: R15.2 6.9,21.88 Q6.4
$1N2901: length 2.2
  Top Layer w0.381: R10.2 6.82,6.81 Q1.4
$1N2902: length 2.2
  Top Layer w0.381: Q3.4 6.82,14.3 R12.2
$1N2903: length 2.2
  Top Layer w0.381: Q5.4 6.94,21.92 R14.2
$1N2950: length 4.6
  Top Layer w0.508: C53.2 28.57,10.73 U4.8 28.86,12.97 U22.1
$1N2954: length 4.6
  Top Layer w0.508: C54.2 28.57,20.51 U5.8 30.71,22.34 U23.1
$1N2971: length 2.4
  Bottom Layer w0.254: C23.2 30.24,12.63 U1.29
$1N2984: length 4.6
  Top Layer w0.508: U8.1 28.86,3.44 U3.8 28.57,1.2 C52.2
$1N2992: length 1.4
  Top Layer w0.254: R19.2 48.13,0.9 LED1.1
$2N6146: length 2.3
  Bottom Layer w0.254: 36.61,4.31 35.06,2.76 35.06,2.65
$2N6183: length 2.1
  Top Layer w0.381: Q11.4 59.94,12.49 R26.2
$2N6187: length 2
  Top Layer w0.381: Q7.4 59.94,27.49 R24.2
$2N6190: length 2.1
  Top Layer w0.381: Q9.4 59.94,19.99 R25.2
$2N6208: length 1.6
  Top Layer w0.254: LED2.1 19.25,1.02 R38.2
$2N6226: length 2.1
  Bottom Layer w0.381: R22.2 59.94,19.95 Q10.4
$2N6227: length 2.1
  Bottom Layer w0.381: R23.2 59.94,12.45 Q12.4
$2N6229: length 1.9
  Bottom Layer w0.381: Q8.4 59.94,27.45 R21.2
$2N6248: length 4.9
  Top Layer w0.457: C56.2 37.46,17.74 U16.8 35.33,16.17 U25.1
$2N6252: length 4.9
  Top Layer w0.457: C55.2 37.46,27.27 U15.8 35.36,25.7 U24.1
$2N6253: length 5
  Top Layer w0.457: C57.2 37.55,8.18 U17.8 37.2,6.34 U26.1

## Copper pours and planes (outline as drawn; the poured copper is in the pictures)
5V on Bottom Layer: 41.97,22.99 43.18,22.99 43.31,22.86 43.31,21.89 42.86,21.45 42.86,20.26 42.67,20.07 42.04,20.07 41.52,20.58 41.52,22.54
12V on Bottom Layer: 36.28,26.61 36.89,27.22 41.03,27.22 41.56,26.69 41.56,23.15 41.15,22.73 38.23,22.73 37.72,23.24 37.72,25.4 37.59,25.53 36.67,25.53 36.28,25.91
+12V on Bottom Layer: 28.87,20.32 29.27,20.72 31.1,20.72 31.24,20.57 31.24,19.81 30.99,19.56 29.44,19.56 28.87,20.12
+12V on Bottom Layer: 21.57,19.05 21.57,19.93 22.27,20.63 25.64,20.63 26.03,20.23 26.03,19 25.2,18.16 25.2,16.8 25.41,16.58 26.34,16.58 26.62,16.3 26.62,15.5 26.31,15.19 23.4,15.19 22.67,15.93 21.84,15.93 21.59,16.18 21.59,19.05
GND on Top Layer: -1.65,41.27 66.17,41.27 70.49,36.96 70.49,2.03 66.04,-2.41 -2.79,-2.41 -6.98,1.78 -6.98,35.94
GND on Bottom Layer: -5.72,35.94 0.64,42.29 60.58,42.29 66.93,35.94 66.93,0.89 60.71,-5.33 0.51,-5.33 -5.72,0.89
GND on Inner1: -5.21,32.13 4.83,42.16 60.83,42.16 70.61,32.38 70.61,4.83 60.71,-5.08 5.08,-5.08 -5.21,5.21
GND on Inner2: -4.95,34.16 2.54,41.66 62.36,41.66 70.23,33.78 70.23,4.06 62.74,-3.43 2.29,-3.43 -5.08,3.94 -4.95,4.06
VBAT on Top Layer: 22.22,38.61 24.38,40.77 41.66,40.77 43.81,38.61 43.81,30.1 43.05,29.34 22.99,29.34 22.22,30.1
VBAT on Bottom Layer: 32,28.19 32.26,28.45 33.03,28.45 33.28,28.19 33.28,26.95 32.99,26.66 32.27,26.66 32,26.92
V_MOS on Top Layer: 8.13,28.57 13.72,34.16 17.91,34.16 18.41,33.65 18.41,7.99 17.32,6.89 9.24,6.89 8.13,8
V_MOS_2 on Top Layer: 47.75,33.4 48.26,33.91 52.58,33.91 57.91,28.57 57.91,7.45 57.13,6.66 48.82,6.66 47.75,7.73
VS_A on Top Layer: 0.25,12.3 0.76,12.81 7.24,12.81 7.75,12.3 7.75,9 7.24,8.49 6.22,8.49 5.84,8.11 5.84,7.48 5.33,6.97 0.76,6.97 0.25,7.48
VS_A_2 on Top Layer: 58.17,25.53 58.79,26.15 59.93,26.15 60.32,26.54 60.32,27.3 60.83,27.81 65.28,27.81 65.79,27.3 65.79,22.35 65.28,21.84 58.93,21.84 58.17,22.61
VS_B on Top Layer: 0.32,19.8 0.83,20.31 7.3,20.31 7.81,19.8 7.81,16.5 7.3,15.99 6.29,15.99 5.91,15.61 5.91,14.98 5.4,14.47 0.83,14.47 0.32,14.98
VS_B_2 on Top Layer: 58.17,18.03 58.79,18.65 59.93,18.65 60.32,19.04 60.32,19.8 60.83,20.31 65.28,20.31 65.79,19.8 65.79,14.85 65.28,14.34 58.93,14.34 58.17,15.11
VS_C on Top Layer: 0.38,27.3 0.89,27.81 7.37,27.81 7.87,27.3 7.87,24 7.37,23.49 6.35,23.49 5.97,23.11 5.97,22.48 5.46,21.97 0.89,21.97 0.38,22.48
VS_C_2 on Top Layer: 58.17,10.53 58.79,11.15 59.93,11.15 60.32,11.54 60.32,12.3 60.83,12.81 65.28,12.81 65.79,12.3 65.79,7.35 65.28,6.84 58.93,6.84 58.17,7.61

Small or netless copper shapes (teardrops, artwork), in the pictures only: 159 on Top Layer, 166 on Bottom Layer, 57 on Inner2

## Text on the board
Bottom Silkscreen Layer: Ver 3.0 Designed by | simplemaxq
